# Altium schematic sheet 01_power.SchDoc: BioGAP ExG shield
size A3; Author: Sebastian Frey; DrawnBy: Sebastian Frey; Engineer: Sebastian Frey; Organization: Integrated System Laboratory; DocumentNumber: 1; Revision: v1.0; SheetNumber: 1; SheetTotal: 4
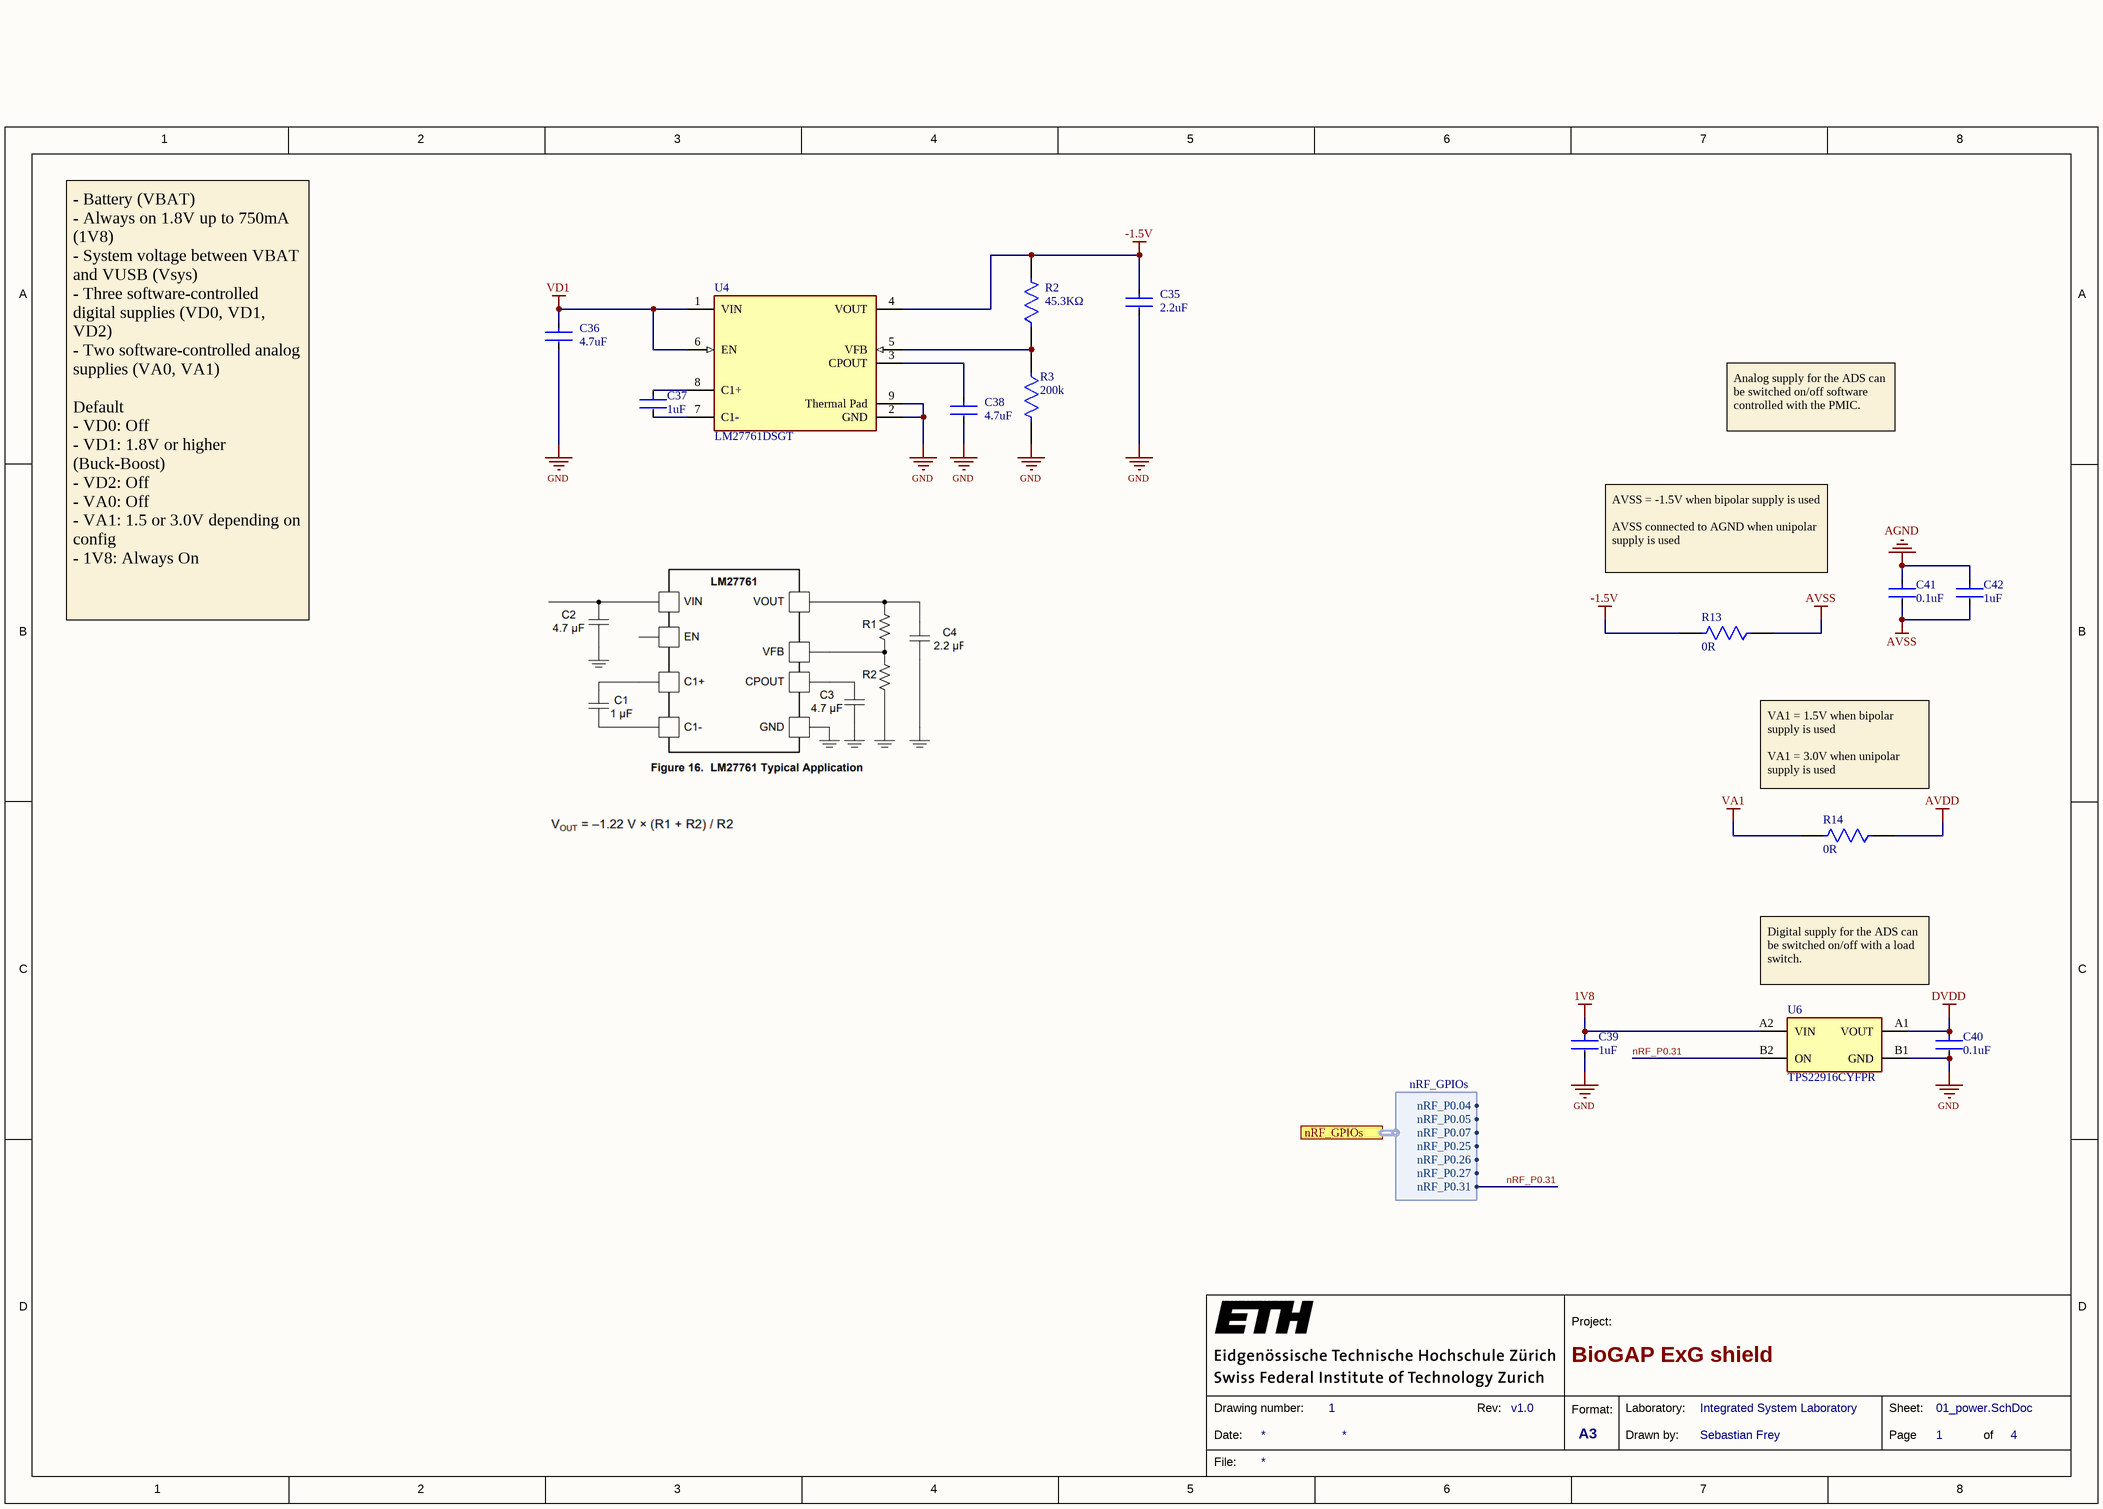
[diagram p0: 01_power.SchDoc]

## Parts
C35  Capacitance: 2.2uF  [FP-GRM155-0_15-IPC_B]  (hidden comment: GRM155Z71A225KE01D)
C36  Capacitance: 4.7uF  [FP-CL282-IPC_C]  (hidden comment: CL05A475MP5NRNC)
C37  Capacitance: 1uF  [FP-CL511-IPC_C]  (hidden comment: CL05A105KP5NNNC)
C38  Capacitance: 4.7uF  [FP-CL282-IPC_C]  (hidden comment: CL05A475MP5NRNC)
C39  Capacitance: 1uF  [FP-CL511-IPC_C]  (hidden comment: CL05A105KP5NNNC)
C40  Capacitance: 0.1uF  [FP-CL278-IPC_C]  (hidden comment: CL05A104KA5NNNC)
C41  Capacitance: 0.1uF  [FP-CL278-IPC_C]  (hidden comment: CL05A104KA5NNNC)
C42  Capacitance: 1uF  [FP-CL511-IPC_C]  (hidden comment: CL05A105KP5NNNC)
R2  Resistance: 45.3KΩ  [FP-RT0402-MFG]  (hidden comment: RT0402BRD0745K3L)
R3  Resistance: 200k  [FP-RN73R1E-IPC_C]  (hidden comment: RN73R1ETTP2003B25)
R13  Resistance: 0R  [FP-RC0402-0_4-IPC_A]  (hidden comment: RC0402FR-070RL)
R14  Resistance: 0R  [FP-RC0402-0_4-IPC_A]  (hidden comment: RC0402FR-070RL)
U4  LM27761DSGT  [FP-DSG0008A-MFG]
U6  TPS22916CYFPR  [BGA4C40P2X2_78X78X50]

## Ports
nRF_GPIOs (harness nRF_GPIOs)

## Harnesses
nRF_GPIOs: nRF_P0.07, nRF_P0.25, nRF_P0.05, nRF_P0.04, nRF_P0.26, nRF_P0.27, nRF_P0.31

## Nets
1V8: C39.1 U6.A2(VIN)
-1.5V: C35.1 R2.2 R13.2 U4.4(VOUT)
AGND: C41.1 C42.1
AVDD: R14.1
AVSS: C41.2 C42.2 R13.1
DVDD: C40.1 U6.A1(VOUT)
GND: C35.2 C36.2 C38.2 C39.2 C40.2 R3.2 U4.2(GND) U4.9(Thermal_Pad) U6.B1(GND)
VA1: R14.2
VD1: C36.1 U4.1(VIN) U4.6(EN)
nRF_P0.31: U6.B2(ON) ; port nRF_GPIOs.nRF_P0.31
NetC37_1: C37.1 U4.8(C1+)
NetC37_2: C37.2 U4.7(C1-)
NetC38_1: C38.1 U4.3(CPOUT)
NetR2_1: R2.1 R3.1 U4.5(VFB)

## Notes on the sheet
- Analog supply for the ADS can be switched on/off software controlled with the PMIC.
- AVSS = -1.5V when bipolar supply is used
  AVSS connected to AGND when unipolar supply is used
- - Battery (VBAT)
  - Always on 1.8V up to 750mA (1V8)
  - System voltage between VBAT and VUSB (Vsys)
  - Three software-controlled digital supplies (VD0, VD1, VD2)
  - Two software-controlled analog supplies (VA0, VA1)
  Default
  - VD0: Off
  - VD1: 1.8V or higher (Buck-Boost)
  - VD2: Off
  - VA0: Off
  - VA1: 1.5 or 3.0V depending on config
  - 1V8: Always On
- VA1 = 1.5V when bipolar supply is used
  VA1 = 3.0V when unipolar supply is used
- Digital supply for the ADS can be switched on/off with a load switch.
- 1
- 2
- 3
- 4
- 5
- 6
- 7
- 8
- A
- B
- C
- D
- Project:
- Date:
- Drawing number:
- Rev:
- Format:
- A3
- Drawn by:
- Laboratory:
- Page
- Sheet:
- of
- File:

## Library data of the parts
C35 = CMP-06035-048202-1: Chip Multilayer Ceramic Capacitors for General Purpose, 0402, 2.2uF, X7R, 15%, 10%, 10V; Value: 2.2uF
C36 C38 = CMP-13271-000548-1: Cap Ceramic 4.7uF 10V X5R ±20% SMD 0402 +85°C Paper T/R; Max Operating Temperature: 85°C; Lead Free: Lead Free; Tolerance: 20%; Voltage Rating: 10V; Dielectric: X5R; Width: 0.02inch; Length: 0.039inch; Case/Package: 0402; Min Operating Temperature: -55°C; Packaging: Tape and Reel; Thickness: 0.022inch; Case Code (Imperial): 0402; Package Quantity: 10000; Case Code (Metric): 1005; Mount: Surface Mount; Value: 4.7uF
C37 C39 C42 = CMP-13271-001936-1: Cap Ceramic 1uF 10V X5R ±10% SMD 0402 +85°C Paper T/R; Depth: 0.5mm; Case Code (Imperial): 0402; Material: Ceramic; Mount: Surface Mount; Thickness: 0.022inch; Dielectric: X5R; Radiation Hardening: No; Case/Package: 0402; Length: 1mm; Tolerance: 10%; Max Operating Temperature: 85°C; Package Quantity: 1; Width: 0.02inch; Voltage Rating: 10V; Contact Plating: Tin; Height: 0.5mm; Min Operating Temperature: -55°C; Case Code (Metric): 1005; Packaging: Tape and Reel; Value: 1uF
C40 C41 = CMP-13271-000728-1: Cap Ceramic 100nF 25V X5R ±10% SMD 0402 +85°C Paper T/R; Value: 0.1uF; Package Quantity: 1; Height: 0.5mm; Case Code (Metric): 1005; Thickness: 0.022inch; Mount: Surface Mount; Lead Free: Lead Free; Case Code (Imperial): 0402; Packaging: Tape and Reel; Depth: 0.5mm; Voltage: 25V; Min Operating Temperature: -55°C; Voltage Rating: 25V; Dielectric: X5R; Case/Package: 0402; Tolerance: 10%; Width: 0.02inch; Max Operating Temperature: 85°C; Length: 1mm; Radiation Hardening: No; Voltage Rating (DC): 25V
R2 = CMP-03412-018483-1: RES 45.3K OHM 1/16W .1% SMD 0402; Manufacturer: Yageo; Value: 45.3KΩ; Voltage Rating: 50V; Temperature Coefficient: 25 ppm/°C; Power Rating: 0.063W; Tolerance: 0.001; Device Class L1: Passive Components; Digikey Description: RES 45.3K OHM 1/16W .1% SMD 0402; Package: RT0402; Composition: Thin Film; Series: RT; ComponentLink2Description: Datasheet; Category: Res; Temperature Range Low: -55°C; Footprint Url: http://www.yageo.com/exep/pages/download/literatures/PYu-R_Mount_10.pdf; Temperature Range High: +155°C; RoHS: TRUE; Lead Free: Yes; Mouser Description: Thin Film Resistors 1/16W 45.3K ohm .1% 25ppm; Temperature: -55°C to +155°C; Device Class L2: Resistors; Manufacturer Part Number: RT0402BRD0745K3L; Ipc Land Pattern Name: RESC10050X30; Automotive: No; ComponentLink2URL: http://www.yageo.com/documents/recent/PYu-RT_1-to-0.01_RoHS_L_9.pdf; Device Class L3: Chip SMD Resistors; Height: 0.35mm; Octopart: https://octopart.com/rt0402brd0745k3l-yageo-1472491
R3 = CMP-04015-050624-1: 200kΩ ±0.1% 0.063W, 1/16W Chip Resistor 0402 (1005 Metric) Moisture Resistant Thin Film; Value: 200k
R13 R14 = CMP-2002-07342-2: RES SMD 0 OHM JUMPER 1/16W 0402; Temperature Coefficient: 200ppm/°C; Tolerance: 1%; Power Rating: 62.5mW; Voltage Rating: 50V; Max Power Dissipation: 63mW; Value: 0R; Features: Moisture Resistant; Length: 1mm; Case Code (Metric): 1005; Series: RC; RoHS Compliant: Yes; Resistor Type: Thick Film; Height: 0.35mm; Min Operating Temperature: -55°C; Case Code (Imperial): 0402; Number of Terminations: 2; Contact Plating: Tin; Case/Package: 0402; Size Code: 0402; Termination: SMD/SMT; Max Operating Temperature: 155°C; Width: 0.5mm; Mount: Surface Mount; Lead Free: Lead Free; Packaging: Tape and Reel; Radiation Hardening: No
U4 = CMP-04918-000089-1: IC REG CHARGE PUMP ADJ 8WSON; Manufacturer: Texas Instruments; Output Voltage: -5-1.5V; Nominal Supply Current: 370uA; Number Of Outputs: 1; Negative Voltage Available: true; Output Current: 250mA; Min Supply Voltage: 2.7V; Standoff Height: 0mm; Output Type: AdjustableProgrammable; Switching Frequency: 2MHz; Max Supply Voltage: 5.5V; Max Junction Temp: +125°C; Switching Topology: Charge Pump; Package: DSG0008A; Device Class L2: Power Management ICs; ComponentLink2Description: Datasheet; Temperature: -40°C to +85°C; Automotive: No; Temperature Range High: +85°C; Lead Free: Yes; Temperature Range Low: -40°C; RoHS: TRUE; Digikey Description: IC REG CHARGE PUMP ADJ 8WSON; ComponentLink2URL: http://www.ti.com/lit/ds/symlink/lm27761.pdf; Manufacturer Part Number: LM27761DSGT; Height: 0.8mm; Device Class L1: Integrated Circuits (ICs); Category: IC; Octopart: https://octopart.com/lm27761dsgt-texas+instruments-66646294; Mouser Description: Switching Voltage Regulators Low-Noise Regulated Switched Capacitor; Ambient Temperature Range Low: -40°C; Device Class L3: Voltage Regulators - Switching; Ambient Temperature Range High: +85°C
U6 = TPS22916CYFPR: Integrated Circuit; Manufacturer_Name: Texas Instruments; Datasheet Link: http://www.ti.com/lit/gpn/tps22916; Height: 0.5mm; Manufacturer_Part_Number: TPS22916CYFPR; Mouser Part Number: 595-TPS22916CYFPR; Mouser Price/Stock: https://www.mouser.co.uk/ProductDetail/Texas-Instruments/TPS22916CYFPR?qs=EU6FO9ffTweddKR4NsfVQg%3D%3D; Arrow Part Number: TPS22916CYFPR; Arrow Price/Stock: https://www.arrow.com/en/products/tps22916cyfpr/texas-instruments?region=nac